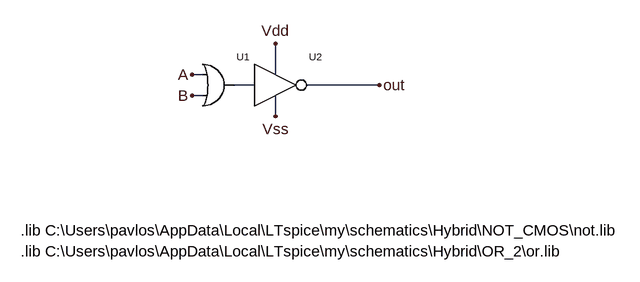
[diagram p0: schematic nor.asc]
nor.asc, the LTspice schematic file:
Version 4
SHEET 1 880 680
WIRE -384 -112 -400 -112
WIRE -272 -112 -272 -160
WIRE -304 -96 -336 -96
WIRE -112 -96 -224 -96
WIRE -384 -80 -400 -80
WIRE -272 -48 -272 -80
FLAG -112 -96 out
FLAG -400 -112 A
FLAG -272 -48 Vss
FLAG -272 -160 Vdd
FLAG -400 -80 B
SYMBOL not -304 -64 R0
SYMATTR InstName U2
SYMBOL or -400 -64 R0
SYMATTR InstName U1
TEXT -664 128 Left 2 !.lib C:\\Users\\pavlos\\AppData\\Local\\LTspice\\my\\schematics\\Hybrid\\NOT_CMOS\\not.lib
TEXT -664 160 Left 2 !.lib C:\\Users\\pavlos\\AppData\\Local\\LTspice\\my\\schematics\\Hybrid\\OR_2\\or.lib

The netlist it stands for:
* nor.asc
XU2 N001 out Vdd Vss not  ; pins A Y Vdd Vss
XU1 A B N001 or  ; pins A B Y
.lib C:\Users\pavlos\AppData\Local\LTspice\my\schematics\Hybrid\NOT_CMOS\not.lib
.lib C:\Users\pavlos\AppData\Local\LTspice\my\schematics\Hybrid\OR_2\or.lib
.backanno
.end